# Altium schematic sheet EP600_M_V1.6.SchDoc
size A4
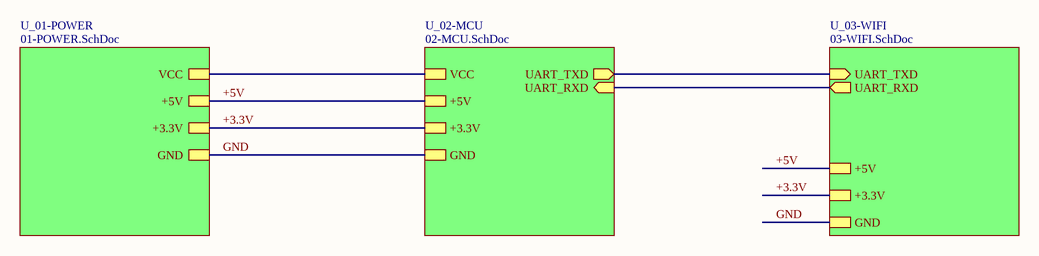
[diagram p0: EP600_M_V1.6.SchDoc]

## Sub-sheets
U_01-POWER = 01-POWER.SchDoc: +5V, +3.3V, GND, VCC
U_02-MCU = 02-MCU.SchDoc: +5V, +3.3V, GND, UART_TXD (out), UART_RXD (in), VCC
U_03-WIFI = 03-WIFI.SchDoc: UART_TXD (in), UART_RXD (out), +5V, +3.3V, GND

## Nets
+3.3V: sheet U_01-POWER/+3.3V, sheet U_02-MCU/+3.3V, sheet U_03-WIFI/+3.3V
+5V: sheet U_01-POWER/+5V, sheet U_02-MCU/+5V, sheet U_03-WIFI/+5V
GND: sheet U_01-POWER/GND, sheet U_02-MCU/GND, sheet U_03-WIFI/GND
(unnamed): sheet U_01-POWER/VCC, sheet U_02-MCU/VCC
(unnamed): sheet U_02-MCU/UART_TXD, sheet U_03-WIFI/UART_TXD
(unnamed): sheet U_02-MCU/UART_RXD, sheet U_03-WIFI/UART_RXD